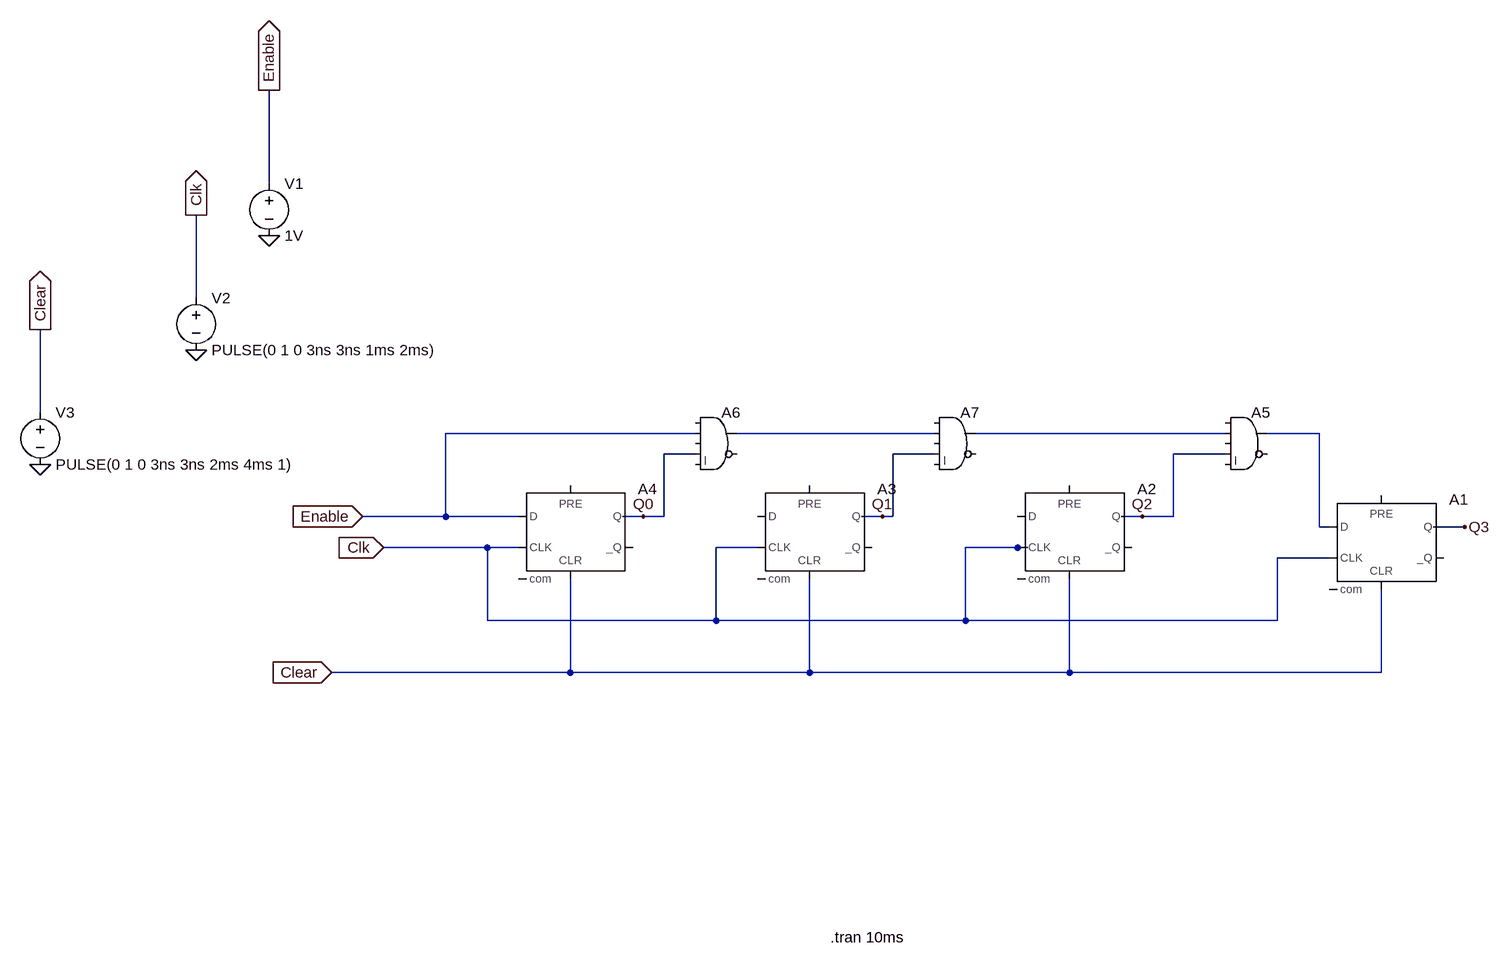
[diagram p0: schematic compt.asc]
compt.asc, the LTspice schematic file:
Version 4
SHEET 1 904 840
WIRE -1040 -336 -1040 -480
WIRE -1152 -160 -1152 -288
WIRE -1392 16 -1392 -112
WIRE -384 48 -768 48
WIRE -16 48 -320 48
WIRE 432 48 48 48
WIRE 576 48 496 48
WIRE -384 80 -432 80
WIRE -16 80 -80 80
WIRE 432 80 352 80
WIRE -768 176 -768 48
WIRE -768 176 -896 176
WIRE -656 176 -768 176
WIRE -464 176 -496 176
WIRE -432 176 -432 80
WIRE -432 176 -464 176
WIRE -96 176 -128 176
WIRE -80 176 -80 80
WIRE -80 176 -96 176
WIRE 304 176 272 176
WIRE 352 176 352 80
WIRE 352 176 304 176
WIRE 576 192 576 48
WIRE 592 192 576 192
WIRE 800 192 752 192
WIRE -704 224 -864 224
WIRE -656 224 -704 224
WIRE -288 224 -352 224
WIRE 112 224 32 224
WIRE 128 224 112 224
WIRE 592 240 512 240
WIRE -704 336 -704 224
WIRE -352 336 -352 224
WIRE -352 336 -704 336
WIRE 32 336 32 224
WIRE 32 336 -352 336
WIRE 512 336 512 240
WIRE 512 336 32 336
WIRE -576 416 -576 272
WIRE -576 416 -944 416
WIRE -208 416 -208 272
WIRE -208 416 -576 416
WIRE 192 416 192 272
WIRE 192 416 -208 416
WIRE 672 416 672 288
WIRE 672 416 192 416
FLAG -464 176 Q0
FLAG -96 176 Q1
FLAG 304 176 Q2
FLAG 800 192 Q3
FLAG -944 416 Clear
IOPIN -944 416 In
FLAG -864 224 Clk
IOPIN -864 224 In
FLAG -896 176 Enable
IOPIN -896 176 In
FLAG -1040 -256 0
FLAG -1392 96 0
FLAG -1152 -80 0
FLAG -1040 -480 Enable
IOPIN -1040 -480 Out
FLAG -1152 -288 Clk
IOPIN -1152 -288 Out
FLAG -1392 -112 Clear
IOPIN -1392 -112 Out
SYMBOL Digital\\dflop 672 144 R0
SYMATTR InstName A1
SYMBOL Digital\\dflop 192 128 R0
SYMATTR InstName A2
SYMBOL Digital\\dflop -208 128 R0
SYMATTR InstName A3
SYMBOL Digital\\dflop -576 128 R0
SYMATTR InstName A4
SYMBOL Digital\\and 464 0 R0
SYMATTR InstName A5
SYMBOL Digital\\and -352 0 R0
SYMATTR InstName A6
SYMBOL Digital\\and 16 0 R0
SYMATTR InstName A7
SYMBOL voltage -1040 -352 R0
WINDOW 123 0 0 Left 0
WINDOW 39 0 0 Left 0
SYMATTR InstName V1
SYMATTR Value 1V
SYMBOL voltage -1152 -176 R0
WINDOW 123 0 0 Left 0
WINDOW 39 0 0 Left 0
SYMATTR InstName V2
SYMATTR Value PULSE(0 1 0 3ns 3ns 1ms 2ms)
SYMBOL voltage -1392 0 R0
WINDOW 123 0 0 Left 0
WINDOW 39 0 0 Left 0
SYMATTR InstName V3
SYMATTR Value PULSE(0 1 0 3ns 3ns 2ms 4ms 1)
TEXT -176 824 Left 2 !.tran 10ms

The netlist it stands for:
* compt.asc
A1 N003 0 Clk 0 Clear 0 Q3 0 DFLOP
A2 0 0 Clk 0 Clear 0 Q2 0 DFLOP
A3 0 0 Clk 0 Clear 0 Q1 0 DFLOP
A4 Enable 0 Clk 0 Clear 0 Q0 0 DFLOP
A5 0 N002 0 Q2 0 0 N003 0 AND
A6 0 Enable 0 Q0 0 0 N001 0 AND
A7 0 N001 0 Q1 0 0 N002 0 AND
V1 Enable 0 1V
V2 Clk 0 PULSE(0 1 0 3ns 3ns 1ms 2ms)
V3 Clear 0 PULSE(0 1 0 3ns 3ns 2ms 4ms 1)
.tran 10ms
.backanno
.end

* Results of the author's LTspice run, read from the files saved beside the schematic
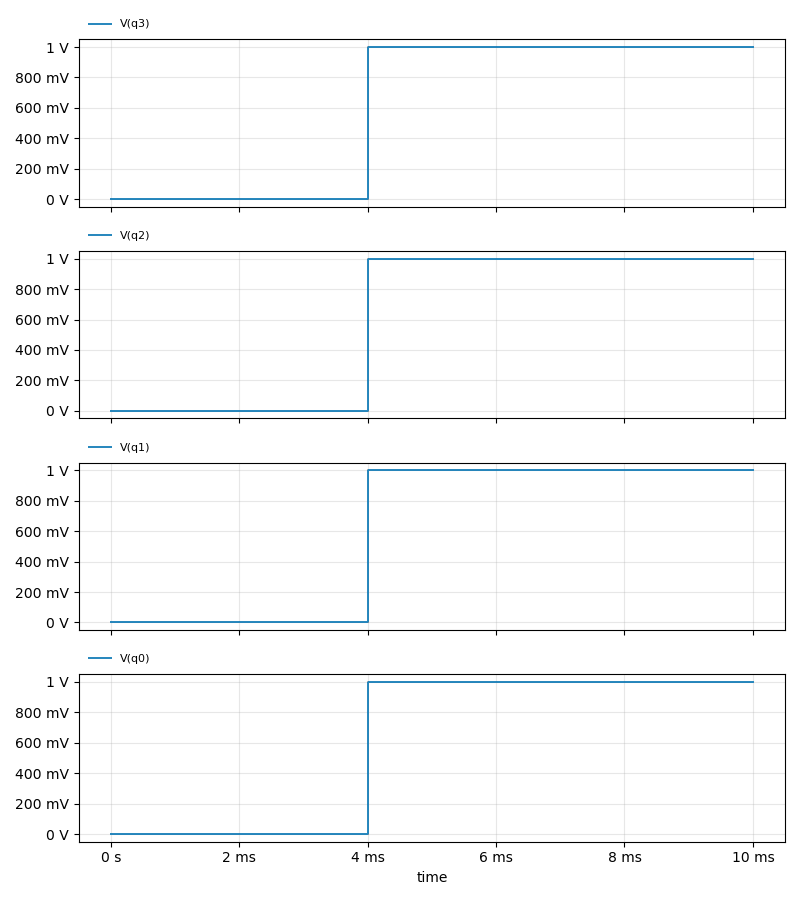
[diagram p1: Transient Analysis of compt.asc, plotted from the saved traces]
* Transient Analysis, 1 run:
*   V(q3): min 0 V, max 1 V, average 600 mV, rms 774.6 mV, last 1 V
*   V(q2): min 0 V, max 1 V, average 600 mV, rms 774.6 mV, last 1 V
*   V(q1): min 0 V, max 1 V, average 600 mV, rms 774.6 mV, last 1 V
*   V(q0): min 0 V, max 1 V, average 600 mV, rms 774.6 mV, last 1 V